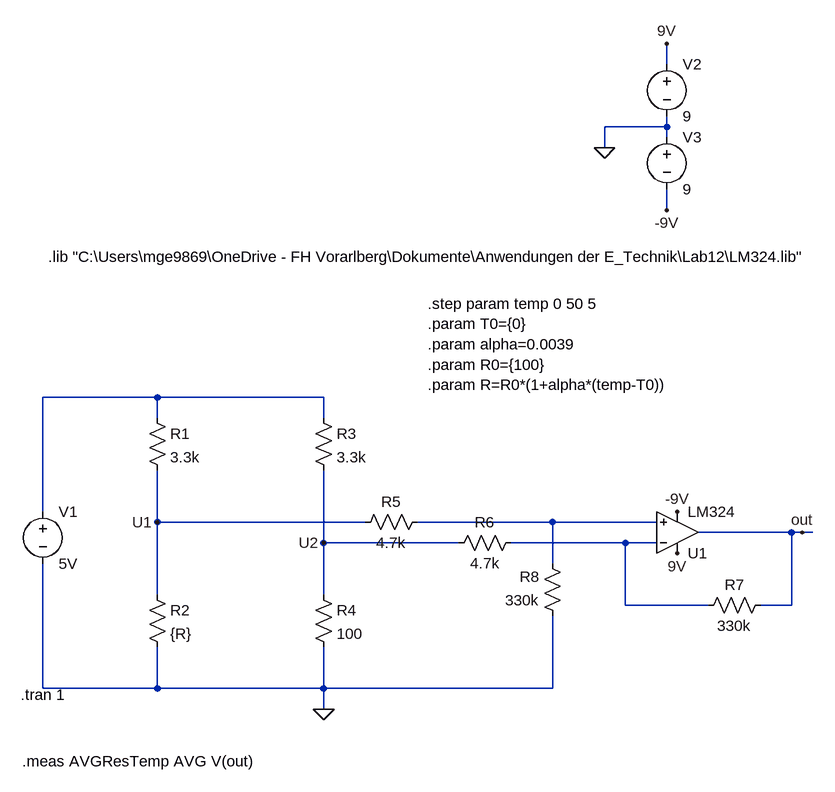
[diagram p0: schematic mitOPV.asc]
mitOPV.asc, the LTspice schematic file:
Version 4
SHEET 1 1312 680
WIRE 944 -544 944 -576
WIRE 944 -448 944 -464
WIRE 944 -448 848 -448
WIRE 944 -432 944 -448
WIRE 848 -416 848 -448
WIRE 944 -320 944 -352
WIRE 160 -32 -16 -32
WIRE 416 -32 160 -32
WIRE 160 0 160 -32
WIRE 416 0 416 -32
WIRE -16 144 -16 -32
WIRE 160 160 160 80
WIRE 480 160 160 160
WIRE 768 160 560 160
WIRE 928 160 768 160
WIRE 1136 176 992 176
WIRE 1152 176 1136 176
WIRE 1168 176 1152 176
WIRE 416 192 416 80
WIRE 624 192 416 192
WIRE 880 192 704 192
WIRE 928 192 880 192
WIRE 768 224 768 160
WIRE 160 272 160 160
WIRE 416 272 416 192
WIRE 880 288 880 192
WIRE 1008 288 880 288
WIRE 1136 288 1136 176
WIRE 1136 288 1088 288
WIRE -16 416 -16 224
WIRE 160 416 160 352
WIRE 160 416 -16 416
WIRE 416 416 416 352
WIRE 416 416 160 416
WIRE 768 416 768 304
WIRE 768 416 416 416
WIRE 416 448 416 416
FLAG 960 208 9V
FLAG 960 144 -9V
FLAG 1152 176 out
FLAG 160 160 U1
FLAG 416 192 U2
FLAG 848 -416 0
FLAG 944 -576 9V
FLAG 944 -320 -9V
FLAG 416 448 0
SYMBOL voltage -16 128 R0
WINDOW 123 0 0 Left 0
WINDOW 39 0 0 Left 0
SYMATTR InstName V1
SYMATTR Value 5V
SYMBOL res 144 -16 R0
SYMATTR InstName R1
SYMATTR Value 3.3k
SYMBOL res 144 256 R0
SYMATTR InstName R2
SYMATTR Value {R}
SYMBOL res 400 -16 R0
SYMATTR InstName R3
SYMATTR Value 3.3k
SYMBOL res 400 256 R0
SYMATTR InstName R4
SYMATTR Value 100
SYMBOL OpAmps\\opamp2 960 240 M180
SYMATTR InstName U1
SYMATTR Value LM324
SYMBOL res 576 144 R90
WINDOW 0 0 56 VBottom 2
WINDOW 3 32 56 VTop 2
SYMATTR InstName R5
SYMATTR Value 4.7k
SYMBOL res 720 176 R90
WINDOW 0 0 56 VBottom 2
WINDOW 3 32 56 VTop 2
SYMATTR InstName R6
SYMATTR Value 4.7k
SYMBOL res 1104 272 R90
WINDOW 0 0 56 VBottom 2
WINDOW 3 32 56 VTop 2
SYMATTR InstName R7
SYMATTR Value 330k
SYMBOL res 784 320 R180
WINDOW 0 36 76 Left 2
WINDOW 3 36 40 Left 2
SYMATTR InstName R8
SYMATTR Value 330k
SYMBOL voltage 944 -560 R0
WINDOW 123 0 0 Left 0
WINDOW 39 0 0 Left 0
SYMATTR InstName V2
SYMATTR Value 9
SYMBOL voltage 944 -448 R0
WINDOW 123 0 0 Left 0
WINDOW 39 0 0 Left 0
SYMATTR InstName V3
SYMATTR Value 9
TEXT 576 -176 Left 2 !.step param temp 0 50 5\n.param T0={0}\n.param alpha=0.0039\n.param R0={100}\n.param R=R0*(1+alpha*(temp-T0))
TEXT -8 -248 Left 2 !.lib "C:\\Users\\mge9869\\OneDrive - FH Vorarlberg\\Dokumente\\Anwendungen der E_Technik\\Lab12\\LM324.lib"
TEXT -50 426 Left 2 !.tran 1
TEXT -48 528 Left 2 !.meas AVGResTemp AVG V(out)

The netlist it stands for:
* mitOPV.asc
V1 N001 0 5V
R1 N001 U1 3.3k
R2 U1 0 {R}
R3 N001 U2 3.3k
R4 U2 0 100
XU1 N002 N003 9V -9V out LM324  ; pins In+ In- V+ V- OUT
R5 N002 U1 4.7k
R6 N003 U2 4.7k
R7 out N003 330k
R8 0 N002 330k
V2 9V 0 9
V3 0 -9V 9
.step param temp 0 50 5
.param T0={0}
.param alpha=0.0039
.param R0={100}
.param R=R0*(1+alpha*(temp-T0))
.lib "C:\Users\mge9869\OneDrive - FH Vorarlberg\Dokumente\Anwendungen der E_Technik\Lab12\LM324.lib"
.tran 1
.meas AVGResTemp AVG V(out)
.backanno
.end